# EAGLE design EIB 1xA79026-001 large pins v1.2 (EAGLE 6.5.0)
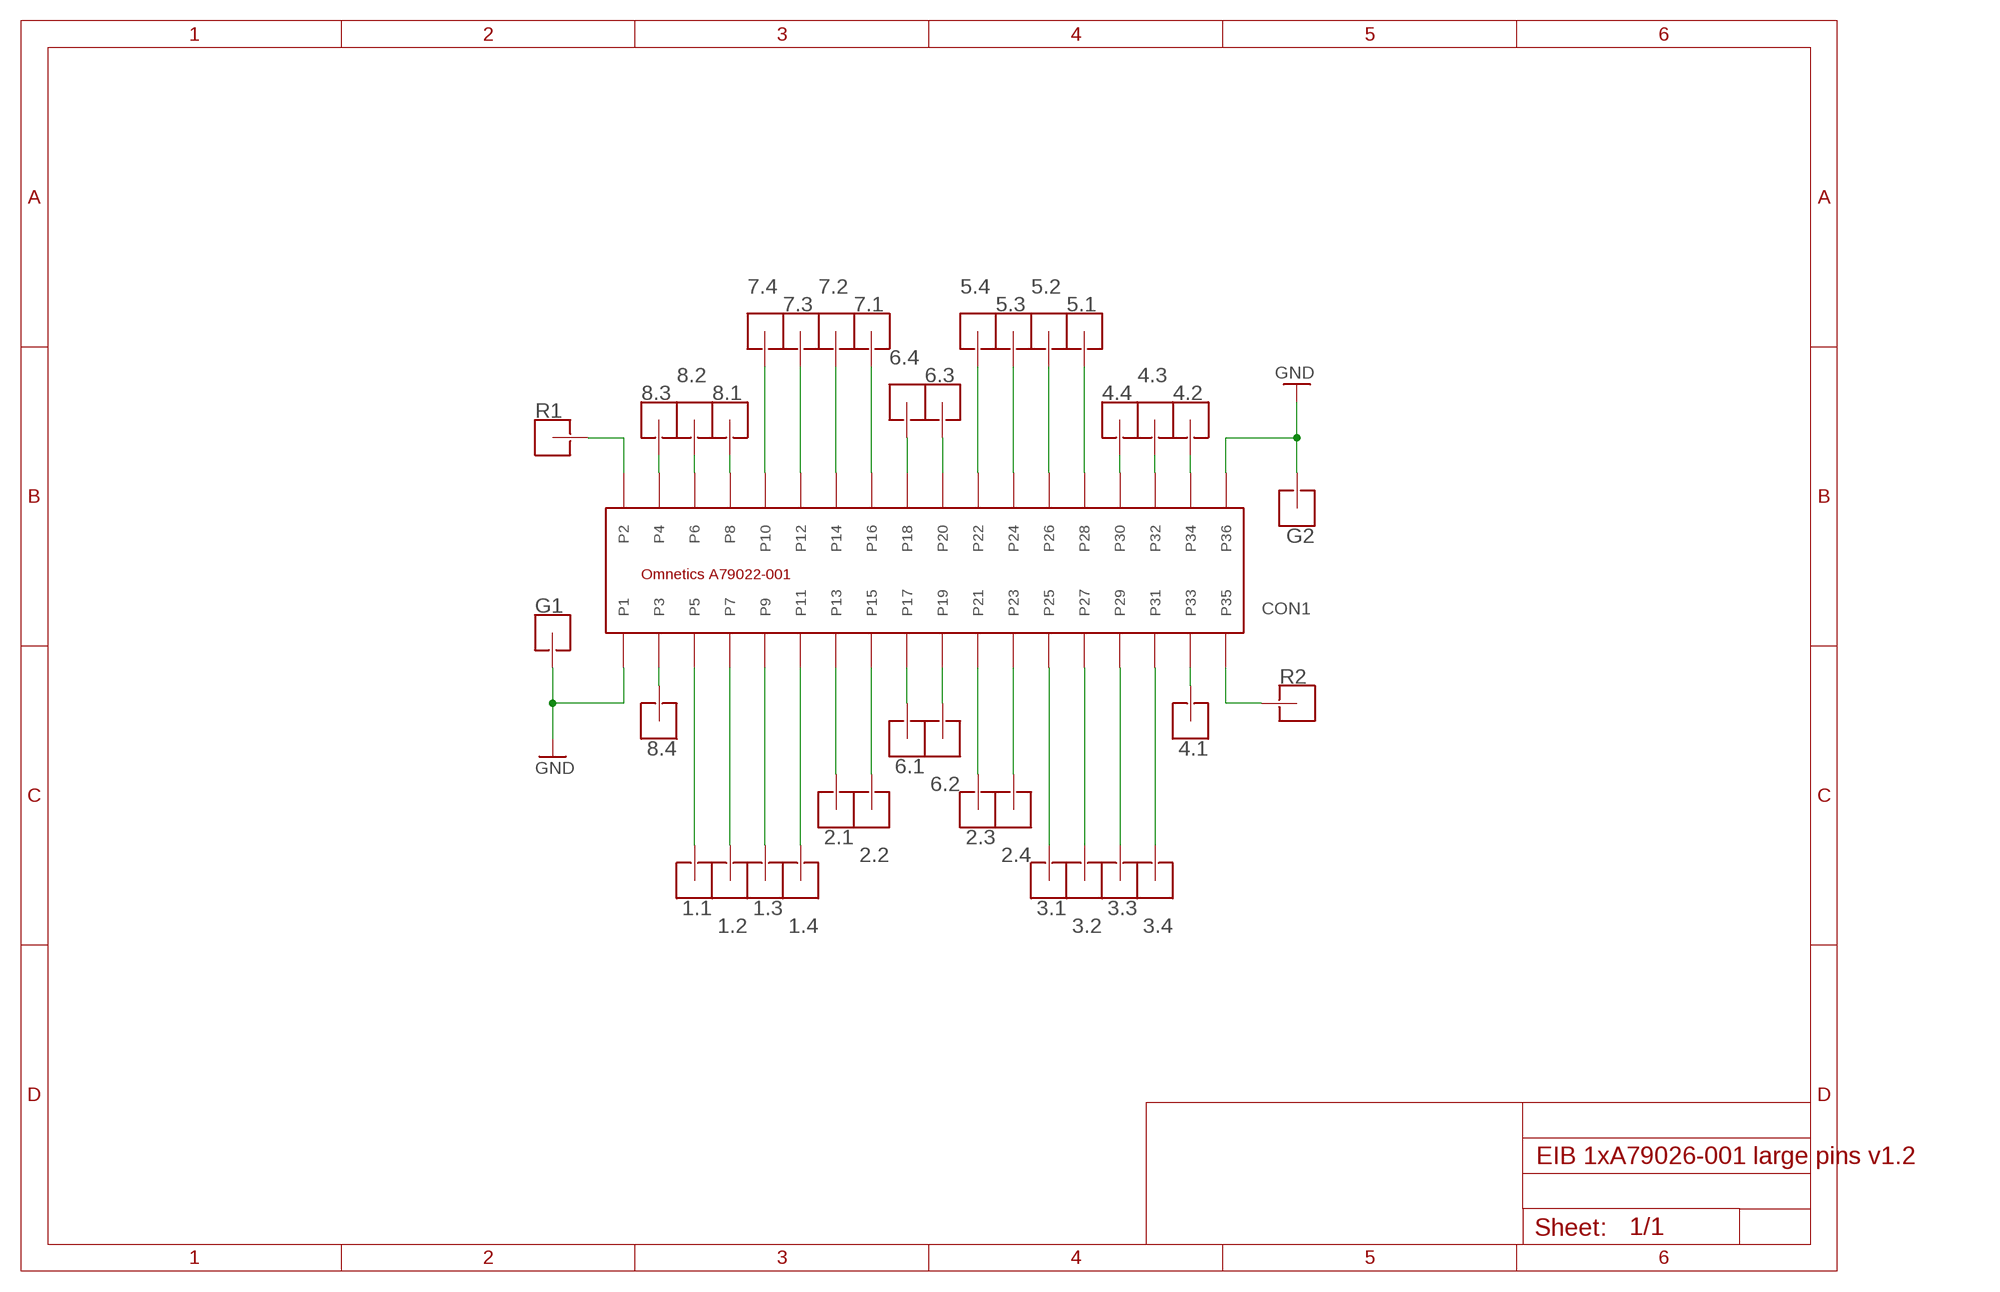
[diagram p0: schematic, sheet 1]

## Parts
1.1  HOLE_L_G_PIN_V5  [LARGE_GOLD_PIN_V5]
1.2  HOLE_L_G_PIN_V5  [LARGE_GOLD_PIN_V5]
1.3  HOLE_L_G_PIN_V5  [LARGE_GOLD_PIN_V5]
1.4  HOLE_L_G_PIN_V5  [LARGE_GOLD_PIN_V5]
2.1  HOLE_L_G_PIN_V5  [LARGE_GOLD_PIN_V5]
2.2  HOLE_L_G_PIN_V5  [LARGE_GOLD_PIN_V5]
2.3  HOLE_L_G_PIN_V5  [LARGE_GOLD_PIN_V5]
2.4  HOLE_L_G_PIN_V5  [LARGE_GOLD_PIN_V5]
3.1  HOLE_L_G_PIN_V5  [LARGE_GOLD_PIN_V5]
3.2  HOLE_L_G_PIN_V5  [LARGE_GOLD_PIN_V5]
3.3  HOLE_L_G_PIN_V5  [LARGE_GOLD_PIN_V5]
3.4  HOLE_L_G_PIN_V5  [LARGE_GOLD_PIN_V5]
4.1  HOLE_L_G_PIN_V5  [LARGE_GOLD_PIN_V5]
4.2  HOLE_L_G_PIN_V5  [LARGE_GOLD_PIN_V5]
4.3  HOLE_L_G_PIN_V5  [LARGE_GOLD_PIN_V5]
4.4  HOLE_L_G_PIN_V5  [LARGE_GOLD_PIN_V5]
5.1  HOLE_L_G_PIN_V5  [LARGE_GOLD_PIN_V5]
5.2  HOLE_L_G_PIN_V5  [LARGE_GOLD_PIN_V5]
5.3  HOLE_L_G_PIN_V5  [LARGE_GOLD_PIN_V5]
5.4  HOLE_L_G_PIN_V5  [LARGE_GOLD_PIN_V5]
6.1  HOLE_L_G_PIN_V5  [LARGE_GOLD_PIN_V5]
6.2  HOLE_L_G_PIN_V5  [LARGE_GOLD_PIN_V5]
6.3  HOLE_L_G_PIN_V5  [LARGE_GOLD_PIN_V5]
6.4  HOLE_L_G_PIN_V5  [LARGE_GOLD_PIN_V5]
7.1  HOLE_L_G_PIN_V5  [LARGE_GOLD_PIN_V5]
7.2  HOLE_L_G_PIN_V5  [LARGE_GOLD_PIN_V5]
7.3  HOLE_L_G_PIN_V5  [LARGE_GOLD_PIN_V5]
7.4  HOLE_L_G_PIN_V5  [LARGE_GOLD_PIN_V5]
8.1  HOLE_L_G_PIN_V5  [LARGE_GOLD_PIN_V5]
8.2  HOLE_L_G_PIN_V5  [LARGE_GOLD_PIN_V5]
8.3  HOLE_L_G_PIN_V5  [LARGE_GOLD_PIN_V5]
8.4  HOLE_L_G_PIN_V5  [LARGE_GOLD_PIN_V5]
CON1  A79022-001_MALESMD  [A79026-001_MALE]
G1  HOLE_L_G_PIN_V5  [LARGE_GOLD_PIN_V5]
G2  HOLE_L_G_PIN_V5  [LARGE_GOLD_PIN_V5]
R1  HOLE_L_G_PIN_V5  [LARGE_GOLD_PIN_V5]
R2  HOLE_L_G_PIN_V5  [LARGE_GOLD_PIN_V5]

## Nets
GND: CON1.P1 CON1.P36 G1.P$1 G2.P$1
N$1: 1.1.P$1 CON1.P5
N$2: 1.2.P$1 CON1.P7
N$3: 1.3.P$1 CON1.P9
N$4: 4.1.P$1 CON1.P33
N$5: 4.3.P$1 CON1.P32
N$6: 4.2.P$1 CON1.P34
N$7: 1.4.P$1 CON1.P11
N$8: 4.4.P$1 CON1.P30
N$9: 6.1.P$1 CON1.P17
N$10: 6.2.P$1 CON1.P19
N$11: 6.3.P$1 CON1.P20
N$12: 7.3.P$1 CON1.P12
N$13: 2.1.P$1 CON1.P13
N$14: 2.2.P$1 CON1.P15
N$15: 2.3.P$1 CON1.P21
N$16: 2.4.P$1 CON1.P23
N$17: 3.1.P$1 CON1.P25
N$18: 3.2.P$1 CON1.P27
N$19: 3.3.P$1 CON1.P29
N$20: 3.4.P$1 CON1.P31
N$21: 6.4.P$1 CON1.P18
N$22: 8.4.P$1 CON1.P3
N$23: 8.3.P$1 CON1.P4
N$24: 8.2.P$1 CON1.P6
N$25: 8.1.P$1 CON1.P8
N$26: 7.2.P$1 CON1.P14
N$27: 7.1.P$1 CON1.P16
N$28: 7.4.P$1 CON1.P10
N$29: 5.1.P$1 CON1.P28
N$30: 5.2.P$1 CON1.P26
N$31: 5.4.P$1 CON1.P22
N$32: 5.3.P$1 CON1.P24
N$34: CON1.P2 R1.P$1
N$35: CON1.P35 R2.P$1

## Library data of the parts
1.1-1.4 2.1-2.4 3.1-3.4 4.1-4.4 5.1-5.4 6.1-6.4 7.1-7.4 8.1-8.4 G1 G2 R1 R2 = holes:HOLE
CON1 = omnetics:A79022-001_MALE

## Board
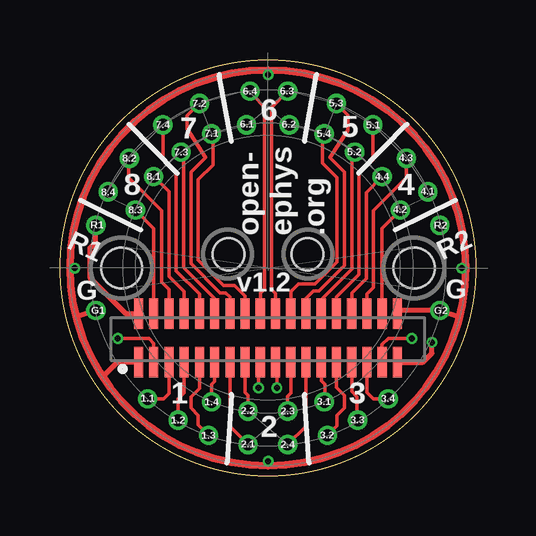
[diagram p1: board, top side]
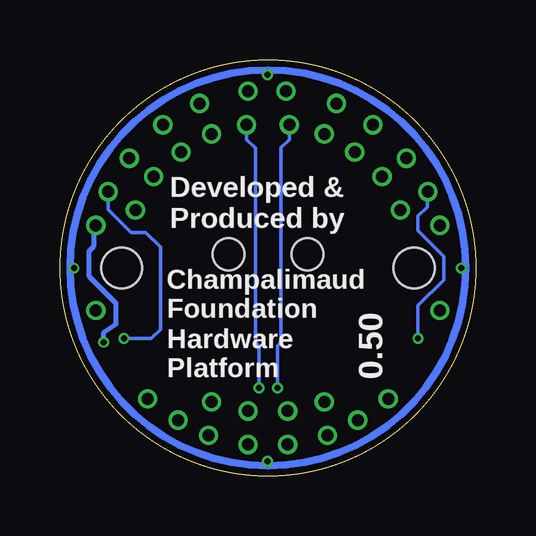
[diagram p2: board, bottom side, seen from below]

Size 17.35 x 17.35 mm. Coordinates in mm from the lower left corner, seen from the top.
Outline: circle at 8.67,8.67 radius 8.67
Copper layers (1*16): Top 0.012mm / dielectric 1.55mm / Bottom 0.012mm
Design rules "eC_2Layer_PClass8_BaseCopperO12 CHANGED": minimum track width 0.1mm, minimum drill 0.2mm, track to track 0.1mm, track to pad 0.1mm, pad to pad 0.1mm, via to via 0.1mm, smd to smd 0mil, copper to edge 0.25mm, drill to drill 0.35mm, minimum pad ring 0.1mm, minimum via ring 0.1mm, stop-mask expansion 0mil, vias tented up to drill 0.45mm, thermal gap 0.2mm
Holes 1.32 mm at 7.02,9.25 10.33,9.25
Holes 1.7 mm at 2.58,8.67 14.77,8.67

### Footprints (pad centres in the part's own frame; a part is rotated, then mirrored left to right if it is on the bottom)
LARGE_GOLD_PIN_V5 = drill 0.5 pad 0.8: P$1 0,0
A79026-001_MALE = smd 0.381 x 1.27: P1 -5.397,-1.016; P2 -5.397,1.016; P3 -4.763,-1.016; P4 -4.763,1.016; P5 -4.128,-1.016; P6 -4.128,1.016; P7 -3.493,-1.016; P8 -3.493,1.016; P9 -2.857,-1.016; P10 -2.857,1.016; P11 -2.223,-1.016; P12 -2.223,1.016; P13 -1.587,-1.016; P14 -1.587,1.016; P15 -0.953,-1.016; P16 -0.953,1.016; P17 -0.318,-1.016; P18 -0.318,1.016; P19 0.318,-1.016; P20 0.318,1.016; P21 0.953,-1.016; P22 0.953,1.016; P23 1.587,-1.016; P24 1.587,1.016; P25 2.223,-1.016; P26 2.223,1.016; P27 2.857,-1.016; P28 2.857,1.016; P29 3.493,-1.016; P30 3.493,1.016; P31 4.128,-1.016; P32 4.128,1.016; P33 4.763,-1.016; P34 4.763,1.016; P35 5.397,-1.016; P36 5.397,1.016

### Placement (x,y rotation side)
1.1  3.66,3.21 0 top
1.2  4.93,2.32 0 top
1.3  6.2,1.69 0 top
1.4  6.32,3.09 0 top
2.1  7.85,1.31 0 top
2.2  7.85,2.71 0 top
2.3  9.5,2.71 0 top
2.4  9.5,1.31 0 top
3.1  11.02,3.09 90 top
3.2  11.15,1.69 90 top
3.3  12.42,2.32 90 top
3.4  13.69,3.21 90 top
4.1  15.34,11.85 270 top
4.2  14.2,11.09 0 top
4.3  14.45,13.25 270 top
4.4  13.44,12.48 0 top
5.1  13.06,14.64 90 top
5.2  12.29,13.5 90 top
5.3  11.53,15.53 90 top
5.4  11.02,14.26 90 top
6.1  7.79,14.64 270 top
6.2  9.56,14.64 0 top
6.3  9.5,16.04 270 top
6.4  7.92,16.04 0 top
7.1  6.32,14.26 270 top
7.2  5.82,15.53 0 top
7.3  5.05,13.5 0 top
7.4  4.29,14.64 0 top
8.1  3.91,12.48 0 top
8.2  2.9,13.25 0 top
8.3  3.15,11.09 0 top
8.4  2.01,11.85 0 top
CON1  8.67,5.75 0 top
G1  1.5,6.9 0 top
G2  15.85,6.9 0 top
R1  1.5,10.45 0 top
R2  15.85,10.45 0 top

### Tracks (layer width: path | path; a pad name or v marks a point on that pad's centre or on a via)
GND  (via drill 0.25)
  Top 0.203: CON1.P1 2.39,4.74 1.75,4.1 1.24,5.12 0.92,5.88 0.86,6.01 0.74,6.64 | G1.P$1 0.74,6.64 | 0.74,6.64 0.48,7.4 0.47,7.59 0.42,8.67 v0.61,8.66 | CON1.P36 14.07,6.9 G2.P$1 16.61,6.64 16.87,7.4 16.87,7.53 16.93,8.67 v16.76,8.66 | v8.69,0.61 8.67,0.42 | v8.69,16.74 8.67,16.93
  Top 0.305: 8.67,0.42 arc90 16.93,8.67 arc90 8.67,16.93 arc90 0.42,8.67 arc90 8.67,0.42
  Bottom 0.203: 0.42,8.67 0.48,9.94 0.74,10.71 | 16.93,8.67 v16.76,8.66
  Bottom 0.305: 8.67,16.93 arc-90 16.93,8.67 arc-90 8.67,0.42 arc-90 0.42,8.67 arc-90 8.67,16.93
N$1
  Top 0.152: CON1.P5 4.55,3.44 4.32,3.21 1.1.P$1
N$2
  Top 0.152: CON1.P7 5.18,3.47 4.93,3.21 1.2.P$1
N$3
  Top 0.152: CON1.P9 5.82,3.65 5.46,3.29 5.46,2.83 5.77,2.53 5.77,2.12 1.3.P$1
N$4  (via drill 0.25)
  Top 0.152: CON1.P33 13.44,5.47 13.69,5.73 v14.68,5.73
  Bottom 0.152: v14.68,5.73 13.54,5.73 13.16,6.11 13.16,9.54 13.77,10.15 14.38,10.15 15.34,11.11 4.1.P$1
N$5
  Top 0.152: CON1.P32 12.8,7.58 13.08,7.86 13.08,11.06 14.45,12.43 4.3.P$1
N$6
  Top 0.152: CON1.P34 13.44,10.33 4.2.P$1
N$7
  Top 0.152: CON1.P11 6.45,3.94 6.32,3.81 1.4.P$1 | 1.4.P$1
N$8
  Top 0.152: CON1.P30 12.17,7.63 12.78,8.24 12.78,11.82 4.4.P$1
N$9  (via drill 0.25)
  Top 0.152: v8.28,3.67 8.28,4.66 CON1.P17
  Bottom 0.152: v8.28,3.67 8.28,5.42 8.13,5.58 8.13,13.69 7.79,14.03 6.1.P$1
N$10  (via drill 0.25)
  Top 0.152: v9.04,3.67 9.04,4.69 CON1.P19
  Bottom 0.152: v9.04,3.67 9.04,5.42 9.2,5.58 9.2,13.67 9.56,14.03 6.2.P$1
N$11
  Top 0.152: 6.3.P$1 8.83,15.37 8.83,7.77 8.99,7.61 CON1.P20
N$12
  Top 0.152: CON1.P12 6.45,7.4 5.16,8.7 5.16,13.4 7.3.P$1
N$13
  Top 0.152: CON1.P13 7.09,2.07 2.1.P$1
N$14
  Top 0.152: CON1.P15 7.72,3.48 7.85,3.35 2.2.P$1 | 2.2.P$1
N$15
  Top 0.152: CON1.P21 9.63,3.46 9.5,3.33 2.3.P$1
N$16
  Top 0.152: CON1.P23 10.26,2.07 2.4.P$1
N$17
  Top 0.152: CON1.P25 10.9,3.96 11.05,3.81 11.05,3.11 3.1.P$1
N$18
  Top 0.152: CON1.P27 11.53,3.7 11.86,3.37 11.86,2.83 11.56,2.53 11.56,2.1 3.2.P$1
N$19
  Top 0.152: CON1.P29 12.17,3.52 12.4,3.29 12.4,2.35 3.3.P$1
N$20
  Top 0.152: CON1.P31 12.8,3.49 13.08,3.21 3.4.P$1
N$21
  Top 0.152: 6.4.P$1 8.52,15.37 8.52,7.8 8.36,7.63 CON1.P18
N$22  (via drill 0.25)
  Top 0.152: CON1.P3 3.91,5.53 3.71,5.73 v2.41,5.73
  Bottom 0.152: v2.41,5.73 2.41,7.1 1.35,8.17 1.35,9.16 2.41,10.22 2.41,10.83 2.03,11.21 2.03,11.82 8.4.P$1
N$23
  Top 0.152: CON1.P4 3.91,10.33 8.3.P$1
N$24
  Top 0.152: CON1.P6 4.55,7.79 4.24,8.09 4.24,11.06 2.87,12.43 2.87,13.22 8.2.P$1
N$25
  Top 0.152: CON1.P8 5.18,7.68 4.55,8.32 4.55,11.85 8.1.P$1
N$26
  Top 0.152: CON1.P14 7.09,7.46 6.91,7.63 6.68,7.63 5.46,8.85 5.46,12.66 6.07,13.27 5.31,14.49 5.31,15.02 7.2.P$1
N$27
  Top 0.152: CON1.P16 7.72,7.51 7.29,7.94 6.83,7.94 5.77,9 5.77,12.36 6.38,12.97 6.38,14.21 7.1.P$1
N$28
  Top 0.152: CON1.P10 5.82,7.58 4.85,8.55 4.85,12.66 4.29,13.22 7.4.P$1
N$29
  Top 0.152: CON1.P28 11.53,7.46 12.47,8.4 12.47,12.59 13.06,13.17 5.1.P$1
N$30
  Top 0.152: CON1.P26 10.9,7.35 12.17,8.62 12.17,13.37 5.2.P$1
N$31
  Top 0.152: CON1.P22 9.63,7.68 9.96,8.01 10.64,8.01 11.56,8.93 11.56,12.43 10.95,13.04 10.95,14.19 5.4.P$1
N$32
  Top 0.152: CON1.P24 10.26,7.4 10.57,7.71 10.8,7.71 11.86,8.78 11.86,12.66 11.25,13.27 12.01,14.42 12.01,15.05 5.3.P$1
N$34
  Top 0.203: CON1.P2 2.74,6.77 1.24,8.27 1.24,9.49 1.5,9.74 R1.P$1
N$35  (via drill 0.25)
  Top 0.203: v15.52,5.58 15.52,5.12 15.14,4.74 CON1.P35
  Bottom 0.203: v15.52,5.58 15.52,5.98 15.01,6.34 15.01,7.2 16.13,8.32 16.13,9.39 15.93,9.59 15.93,10.38 R2.P$1

### Text on the board
tPlace: 6 | 7 | 5 | 8 | 4 | R1 | open- / ephys / .org | R2 | G | v1.2 | G | 1 | 3 | 2
bPlace: Developed & / Produced by | Champalimaud / Foundation | 0.50 | Hardware / Platform